# EAGLE schematic SchematicsCleaningBot (EAGLE 9.4.2)
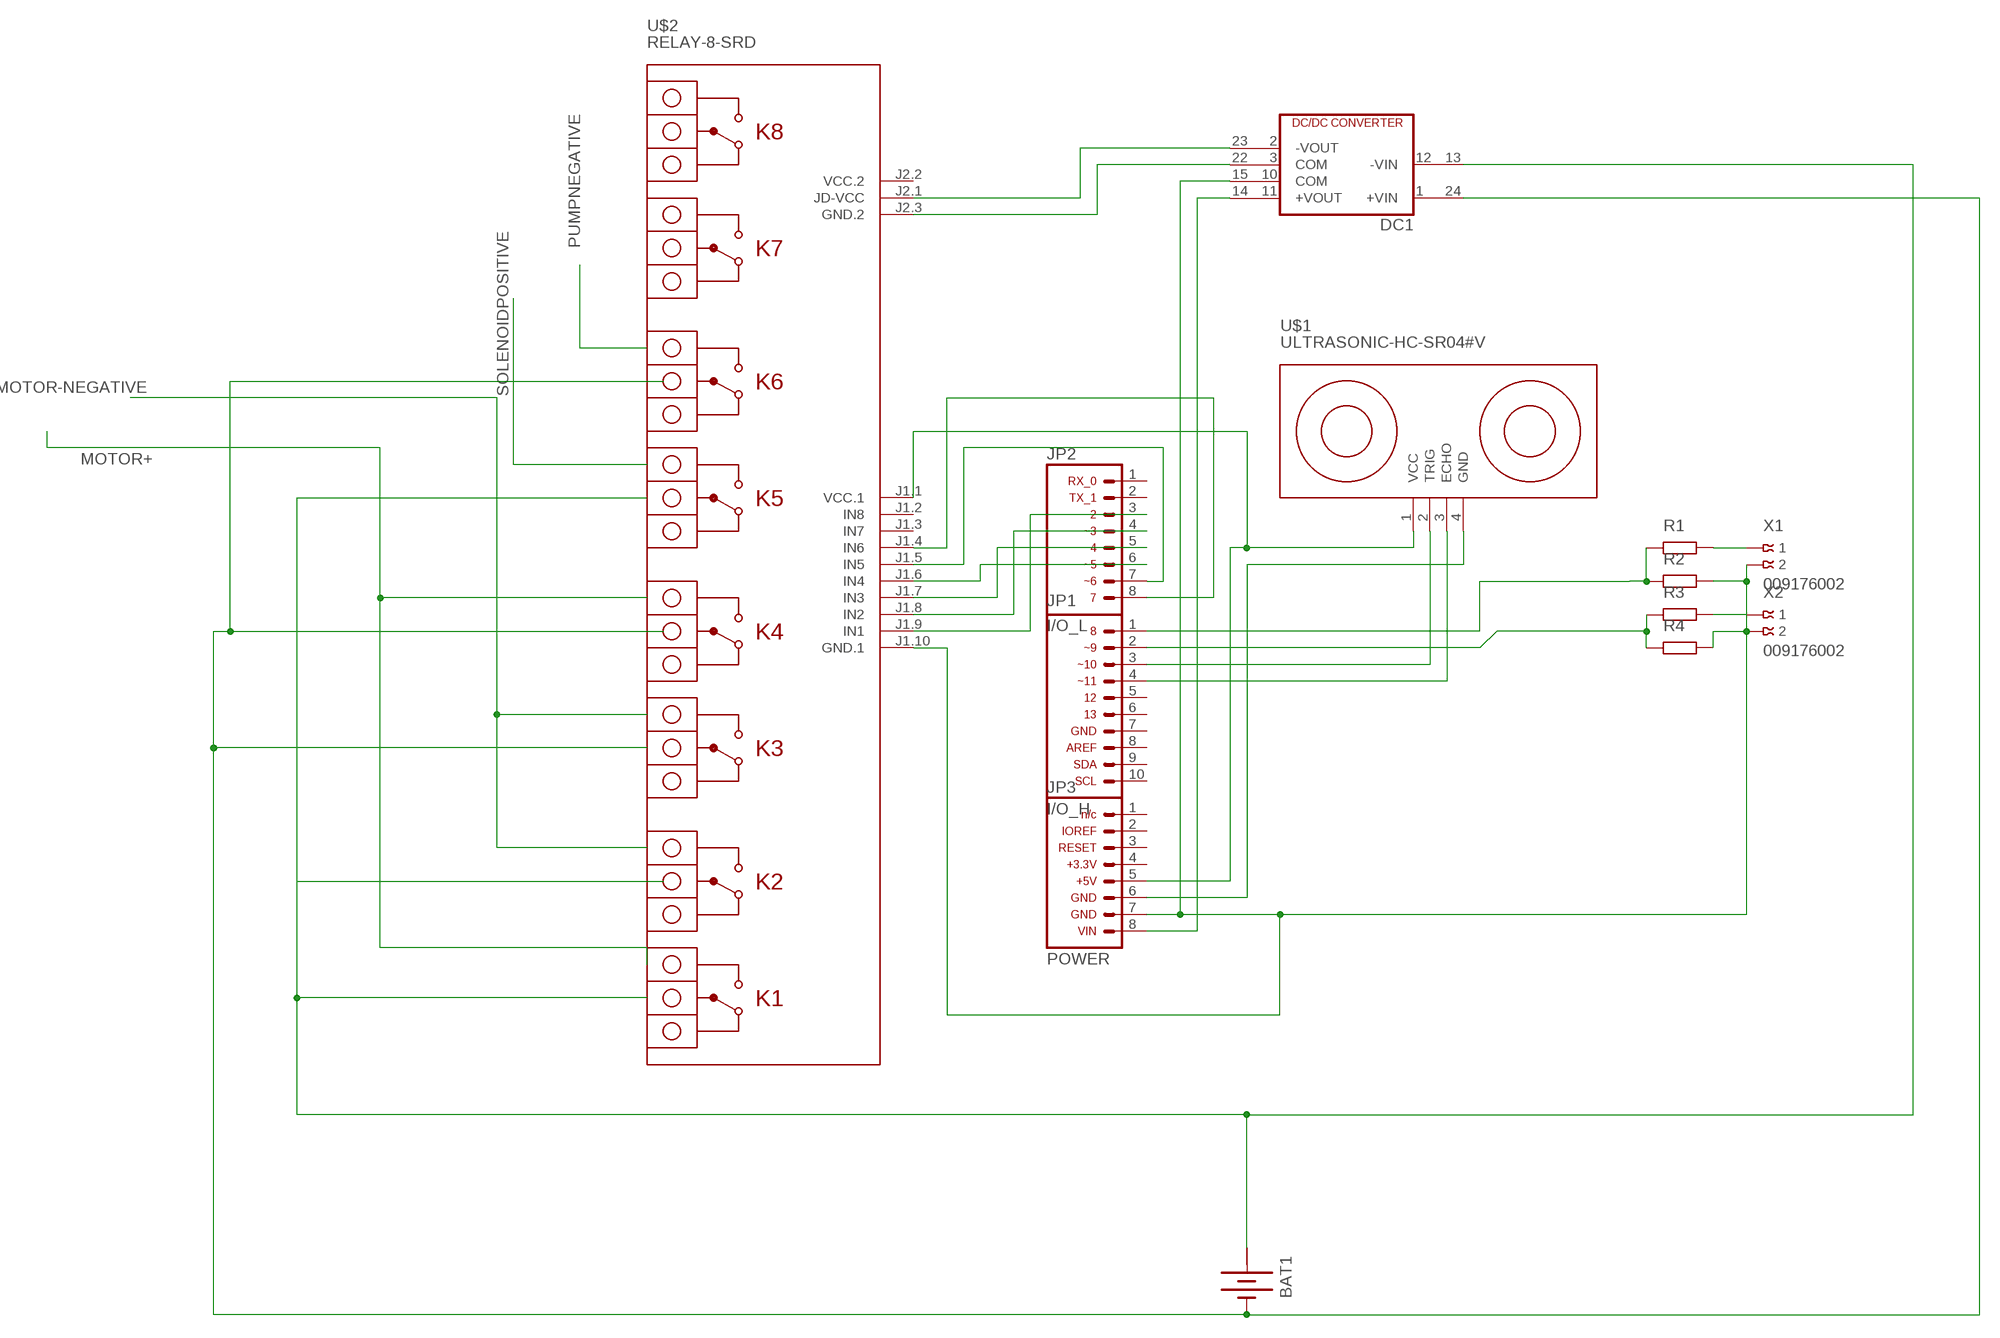
[diagram p0: schematic, sheet 1]

## Parts
BAT1  BATTERY  [BATTERY]
DC1  DCW2C  [DCW]
JP1  ARDUINO_CONN-IO_HSIP  [CONN-1X10]
JP2  ARDUINO_CONN-IO_LSIP  [CONN-1X08]
JP3  ARDUINO_CONN-POWERSIP  [CONN-1X08]
R1  R  (no package)
R2  R  (no package)
R3  R  (no package)
R4  R  (no package)
U$1  ULTRASONIC-HC-SR04#V  [ULTRASONIC-HC-SR04#V]
U$2  RELAY-8-SRD  [RELAY-8-SRD]
X1  009176002  [009176002]
X2  009176002  [009176002]

## Nets
N$1: JP1.3 U$1.2(TRIG)
N$2: JP1.4 U$1.3(ECHO)
N$3: JP3.5 U$1.1(VCC) U$2.J1.1(VCC.1)
N$4: JP3.6 U$1.4(GND)
N$5: JP1.1 R1.1 R2.1
N$6: R1.2 X1.1
N$7: JP1.2 R3.1 R4.1
N$8: DC1.14(+VOUT1) JP3.8
N$9: R3.2 X2.1
N$10: DC1.23(-VOUT1) U$2.J2.1(JD-VCC)
N$11: DC1.22(COM2) U$2.J2.3(GND.2)
N$12: DC1.15(COM1) JP3.7 R2.2 R4.2 U$2.J1.10(GND.1) X1.2 X2.2
N$13: JP2.3 U$2.J1.9(IN1)
N$14: JP2.4 U$2.J1.8(IN2)
N$15: JP2.5 U$2.J1.7(IN3)
N$16: JP2.6 U$2.J1.6(IN4)
N$17: JP2.7 U$2.J1.5(IN5)
N$18: JP2.8 U$2.J1.4(IN6)
N$19: BAT1.+ DC1.13(-VIN1)
N$20: BAT1.- DC1.24(+VIN1)
Unconnected: DC1.1(+VIN) DC1.2(-VOUT) DC1.3(COM) DC1.10(COM) DC1.11(+VOUT) DC1.12(-VIN) JP1.5 JP1.6 JP1.7 JP1.8 JP1.9 JP1.10 JP2.1 JP2.2 JP3.1 JP3.2 JP3.3 JP3.4 U$2.J1.2(IN8) U$2.J1.3(IN7)

## Power pins joined to a net without a drawn wire
+: BAT1.+@1(+)
VCC.2: U$2.J2.2(VCC.2)

## Library data of the parts
BAT1 = special:BATTERY: BATTERY
DC1 = dc-dc-converter:DCW2C: DC-DC CONVERTER; OC_FARNELL: unknown; OC_NEWARK: unknown
JP1 = arduino_jw:ARDUINO_CONN-IO_H: Arduino Digital I/O [High Byte] Header This is the Digital I/O [high byte] header on the Arduino Uno R3. This connector is labeled with the following pin assignments: Digital 8 Digital 9 [PWM] Digital 10 [PWM] Digital 11 [PWM] Digital 12 Digital 13 GND AREF SDA SCL NOTE: Be sure you install this connector with the correct orientation on your PCB layout. Pin 1 has a square pad to assist with orientation.
JP2 = arduino_jw:ARDUINO_CONN-IO_L: Arduino Digital I/O [Low Byte] Header This is the Digital I/O [low byte] header on the Arduino Uno R3. This connector is labeled with the following pin assignments: Digital 0, Serial Rx Digital 1, Serial Tx Digital 2 Digital 4 Digital 5 [PWM] Digital 6 [PWM] Digital 7 NOTE: Be sure you install this connector with the correct orientation on your PCB layout. Pin 1 has a square pad to assist with orientation.
JP3 = arduino_jw:ARDUINO_CONN-POWER: Arduino Power Header This is the power header on the Arduino Uno R3. This connector is labeled with the following pin assignments: n/c IO Ref RESET +3.3V +5V GND GND VIN NOTE: Be sure you install this connector with the correct orientation on your PCB layout. Pin 1 has a square pad to assist with orientation.
R1-R4 = ngspice-simulation:R: RESISTOR
U$1 = diy-modules:ULTRASONIC-HC-SR04: Ultrasonic Ranging Module HC-SR04 More details available here: http://randomnerdtutorials.com/complete-guide-for-ultrasonic-sensor-hc-sr04/ Click here to find device on ebay.com <http://www.ebay.com/sch/hc+sr04+ultrasonic>
U$2 = diy-modules:RELAY-8-SRD: 8-Channel Relay Module based on SRD-05VDC-SL-C relays Click here to find device on ebay.com <http://www.ebay.com/sch/eight+channel+relay+module+optocoupler+5v>
X1 X2 = con-avx:00917?002: Wire to Board Strip IDC Connector 2 WAY Source: http://www.avx.com/docs/Catalogs/9176.pdf http://www.avx.com/docs/Catalogs/9177.pdf; MPN: 009176002001006; OC_FARNELL: 1582834; OC_NEWARK: 66M1960